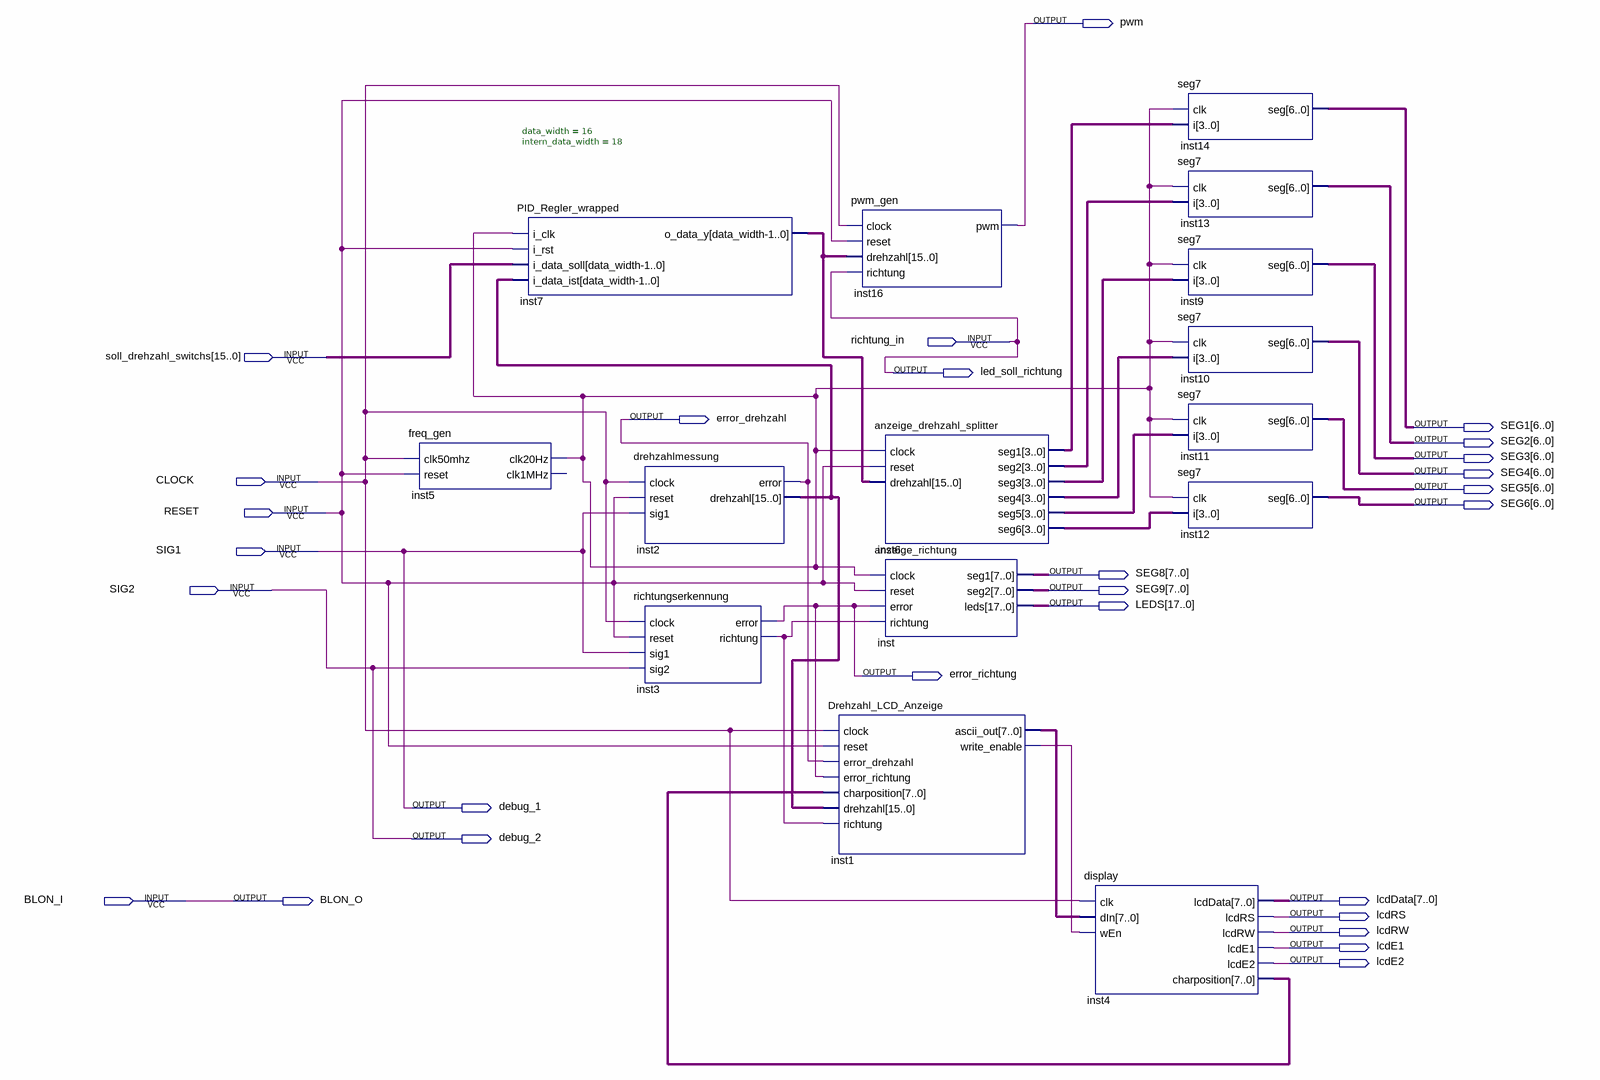
[diagram p0: schematic sheet]
// Quartus schematic Konzept-PID.bdf as structural Verilog: 15 symbols, 28 pins
module \Konzept-PID  (
  input  richtung_in,
  input  [15:0] soll_drehzahl_switchs,
  input  CLOCK,
  input  RESET,
  input  SIG1,
  input  SIG2,
  input  BLON_I,
  output pwm,
  output led_soll_richtung,
  output error_drehzahl,
  output [6:0] SEG1,
  output [6:0] SEG2,
  output [6:0] SEG3,
  output [6:0] SEG4,
  output [6:0] SEG5,
  output [6:0] SEG6,
  output [7:0] SEG8,
  output [7:0] SEG9,
  output [17:0] LEDS,
  output error_richtung,
  output debug_1,
  output debug_2,
  output BLON_O,
  output [7:0] lcdData,
  output lcdRS,
  output lcdRW,
  output lcdE1,
  output lcdE2
);

  wire inst1_write_enable, inst3_richtung, inst5_clk20hz;
  wire [3:0] inst6_seg1, inst6_seg2, inst6_seg3, inst6_seg4, inst6_seg5, inst6_seg6;
  wire [7:0] inst1_ascii_out, inst4_charposition;
  wire [15:0] inst2_drehzahl, inst7_o_data_y;

  freq_gen inst5 (.clk50mhz(CLOCK), .reset(RESET), .clk20Hz(inst5_clk20hz));  // open: clk1MHz
  PID_Regler_wrapped #(.data_width(16), .intern_data_width(18)) inst7 (
    .i_clk(inst5_clk20hz), .i_rst(RESET), .i_data_soll(soll_drehzahl_switchs), .i_data_ist(inst2_drehzahl),
    .o_data_y(inst7_o_data_y));
  drehzahlmessung inst2 (.clock(CLOCK), .reset(RESET), .sig1(SIG1), .error(error_drehzahl), .drehzahl(inst2_drehzahl));
  richtungserkennung inst3 (
    .clock(CLOCK), .reset(RESET), .sig1(SIG1), .sig2(SIG2), .error(error_richtung), .richtung(inst3_richtung));
  Drehzahl_LCD_Anzeige inst1 (
    .clock(CLOCK), .reset(RESET), .error_drehzahl(error_drehzahl), .error_richtung(error_richtung),
    .charposition(inst4_charposition), .drehzahl(inst2_drehzahl), .richtung(inst3_richtung),
    .ascii_out(inst1_ascii_out), .write_enable(inst1_write_enable));
  pwm_gen inst16 (.clock(CLOCK), .reset(RESET), .drehzahl(inst7_o_data_y), .richtung(richtung_in), .pwm(pwm));
  anzeige_drehzahl_splitter inst6 (
    .clock(inst5_clk20hz), .reset(RESET), .drehzahl(inst7_o_data_y), .seg1(inst6_seg1), .seg2(inst6_seg2),
    .seg3(inst6_seg3), .seg4(inst6_seg4), .seg5(inst6_seg5), .seg6(inst6_seg6));
  anzeige_richtung inst (
    .clock(inst5_clk20hz), .reset(RESET), .error(error_richtung), .richtung(inst3_richtung), .seg1(SEG8),
    .seg2(SEG9), .leds(LEDS));
  display inst4 (
    .clk(CLOCK), .dIn(inst1_ascii_out), .wEn(inst1_write_enable), .lcdData(lcdData), .lcdRS(lcdRS),
    .lcdRW(lcdRW), .lcdE1(lcdE1), .lcdE2(lcdE2), .charposition(inst4_charposition));
  seg7 inst14 (.clk(inst5_clk20hz), .i(inst6_seg1), .seg(SEG1));
  seg7 inst13 (.clk(inst5_clk20hz), .i(inst6_seg2), .seg(SEG2));
  seg7 inst9 (.clk(inst5_clk20hz), .i(inst6_seg3), .seg(SEG3));
  seg7 inst10 (.clk(inst5_clk20hz), .i(inst6_seg4), .seg(SEG4));
  seg7 inst11 (.clk(inst5_clk20hz), .i(inst6_seg5), .seg(SEG5));
  seg7 inst12 (.clk(inst5_clk20hz), .i(inst6_seg6), .seg(SEG6));

  assign BLON_O = BLON_I;
  assign debug_1 = SIG1;
  assign debug_2 = SIG2;
  assign led_soll_richtung = richtung_in;
endmodule
